# EAGLE design A6BPSLD-3 (EAGLE 7.5.0)

## Sheet 1 of 2
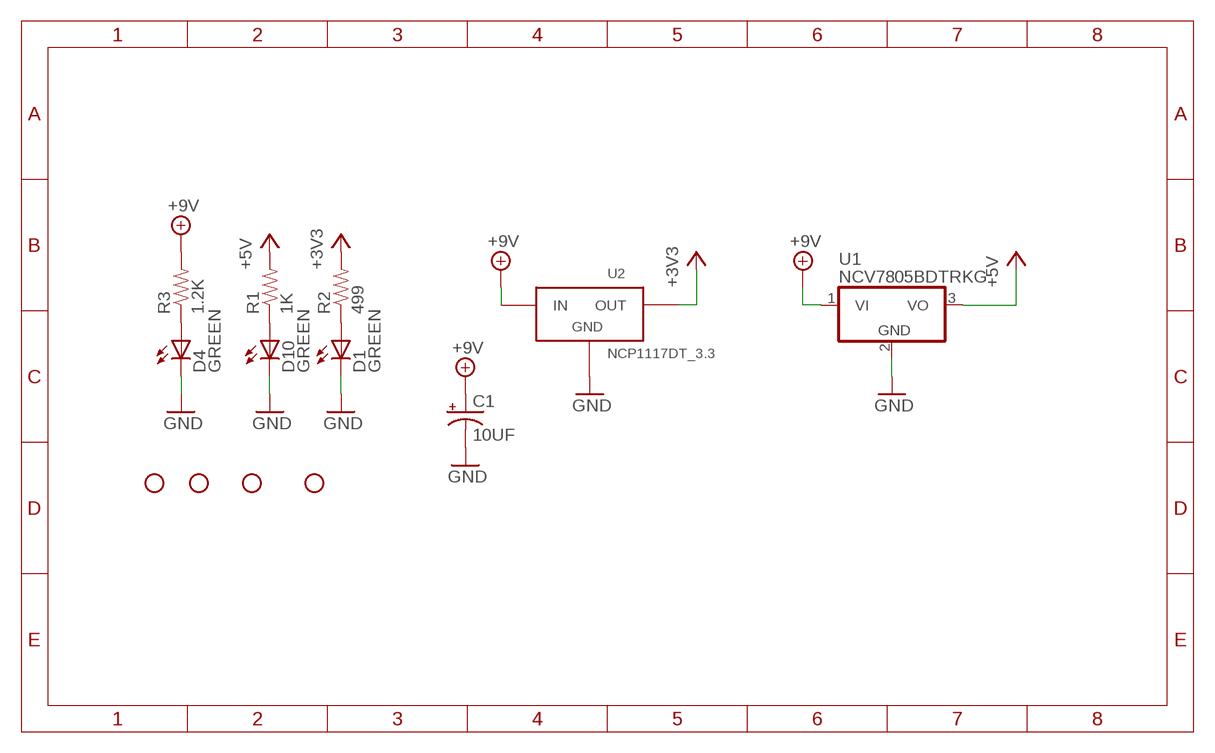
[diagram p0: schematic, sheet 1]

### Parts
C1  10UF  CAP-POL_10UF_16V  [EIA3216-16V]
D1  GREEN  LED_GREEN  [CHIP_LED0805]
D4  GREEN  LED_GREEN  [CHIP_LED0805]
D10  GREEN  LED_GREEN  [CHIP_LED0805]
R1  1K  RES_1K_1%_0805  [0805]
R2  499  RES_499_1%_0805  [0805]
R3  1.2K  RES_1.2K_1%_0805  [0805]
STANDOFF2  STAND-OFF  [STAND-OFF]
STANDOFF6  STAND-OFF  [STAND-OFF]
STANDOFF7  STAND-OFF  [STAND-OFF]
STANDOFF8  STAND-OFF  [STAND-OFF]
U1  NCV7805BDTRKG  [DPAK]
U2  NCP1117DT_3.3  [DPAK]

### Nets
+3V3: R2.2 U2.2(OUT) ; also sheet 2
+5V: R1.2 U1.3(VO) ; also sheet 2
+9V: C1.A(+) R3.2 U1.1(VI) U2.3(IN) ; also sheet 2
GND: C1.C(-) D1.C D4.C D10.C U1.2(GND) U2.1(GND) ; also sheet 2
N$3: D4.A R3.1
N$5: D1.A R2.1
N$8: D10.A R1.1

## Sheet 2 of 2
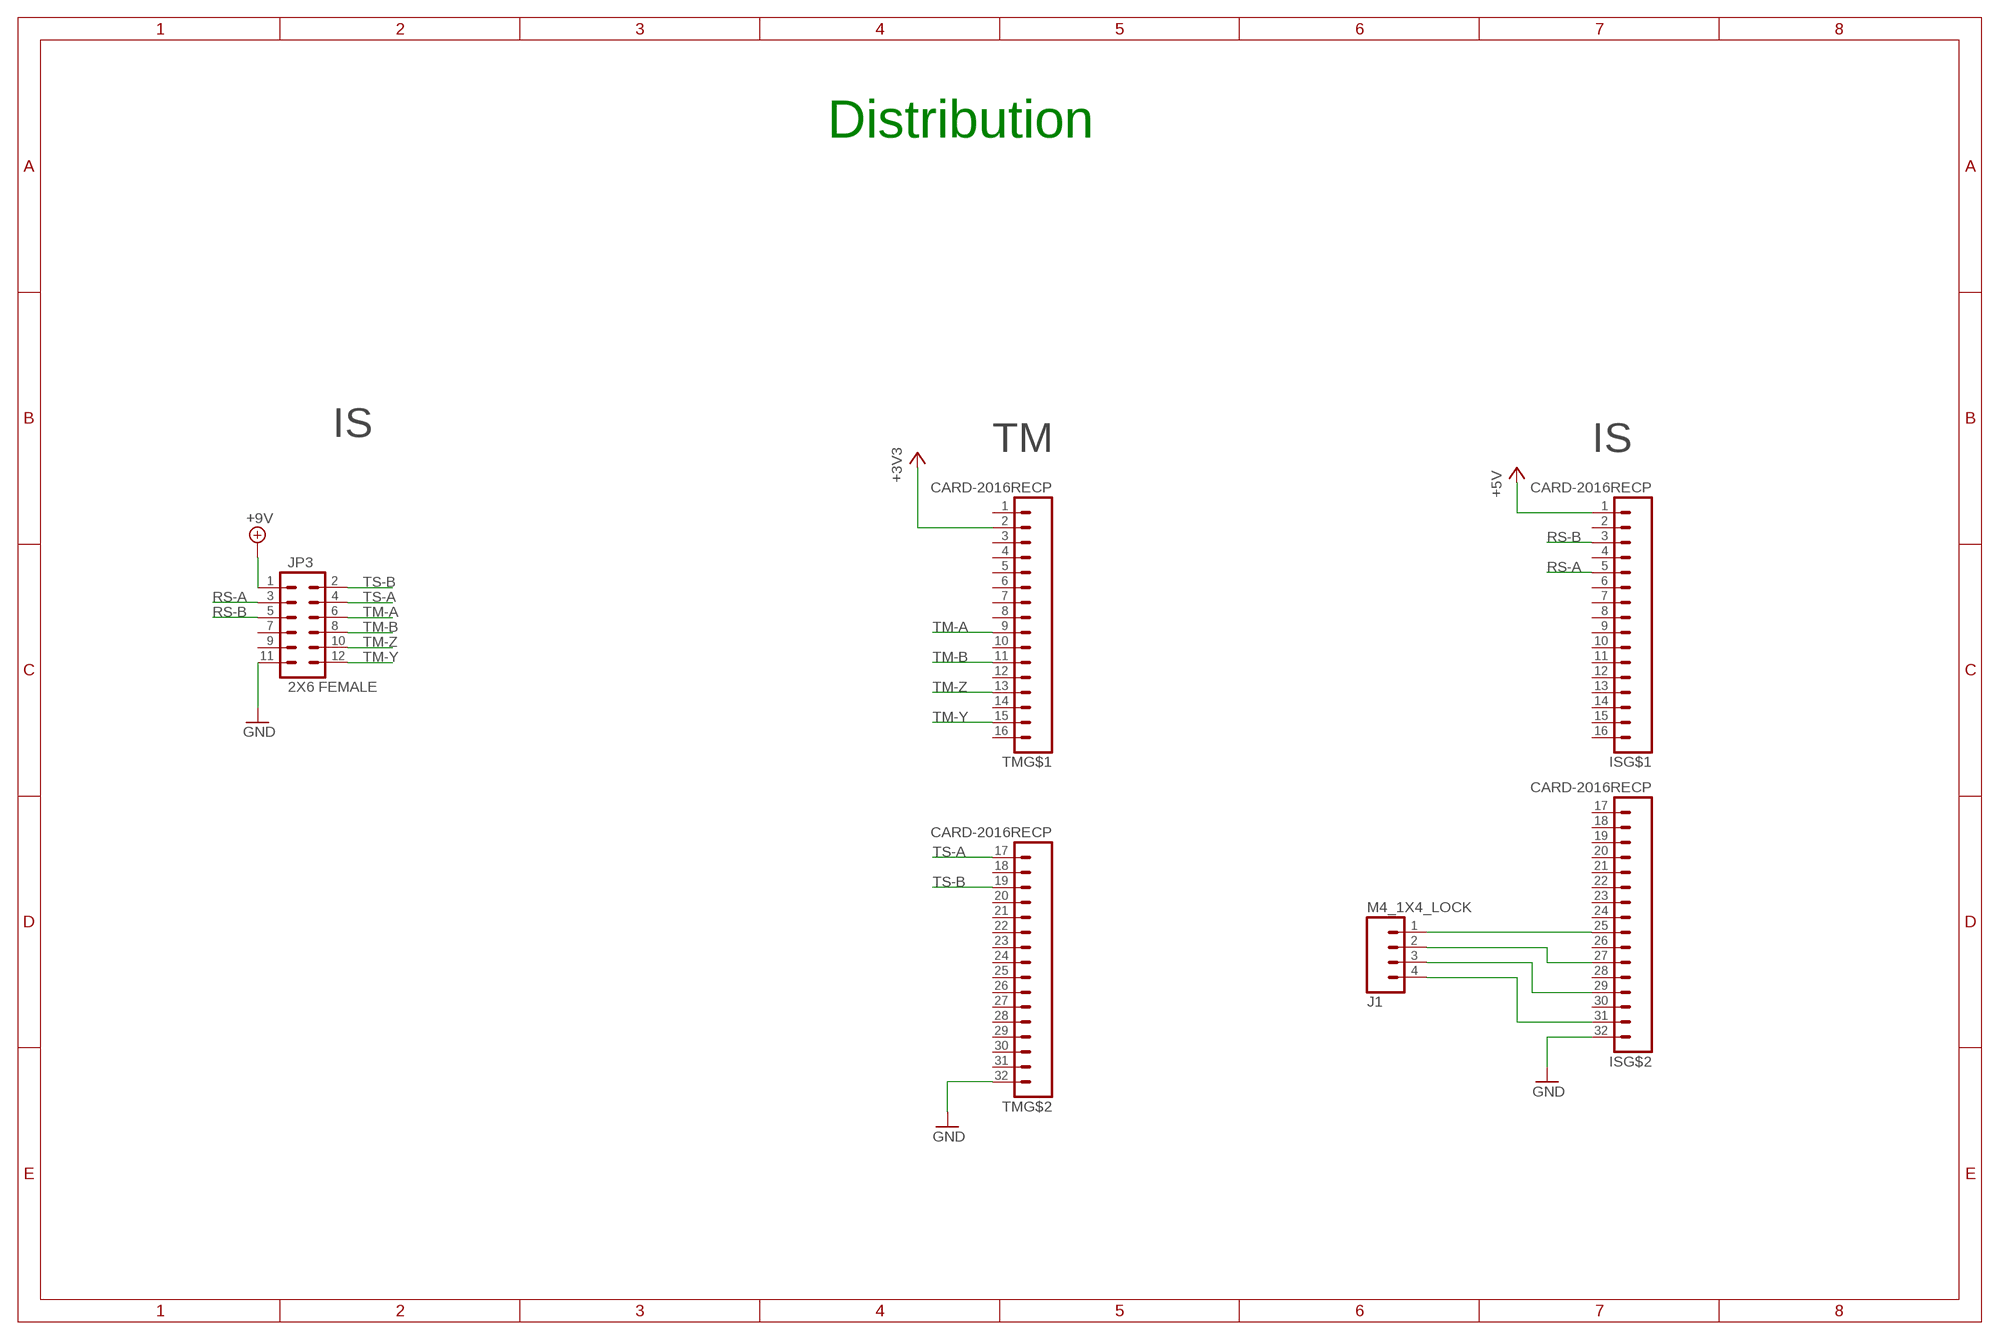
[diagram p1: schematic, sheet 2]

### Parts
IS  CARD-2016RECP  [CARD-2016-RCP]
J1  M4_1X4_LOCK  [MOLEX_1X4]
JP3  2X6 FEMALE  M06X2PTH_FEMALE  [2X6]
TM  CARD-2016RECP  [CARD-2016-RCP]

### Nets
+3V3: TM.2 ; also sheet 1
+5V: IS.1 ; also sheet 1
+9V: JP3.1 ; also sheet 1
GND: IS.32 JP3.11 TM.32 ; also sheet 1
N$6: IS.25 J1.1
N$7: IS.27 J1.2
N$9: IS.29 J1.3
N$10: IS.31 J1.4
RS-A: IS.5 JP3.3
RS-B: IS.3 JP3.5
TM-A: JP3.6 TM.9
TM-B: JP3.8 TM.11
TM-Y: JP3.12 TM.15
TM-Z: JP3.10 TM.13
TS-A: JP3.4 TM.17
TS-B: JP3.2 TM.19
Unconnected: IS.2 IS.4 IS.6 IS.7 IS.8 IS.9 IS.10 IS.11 IS.12 IS.13 IS.14 IS.15 IS.16 IS.17 IS.18 IS.19 IS.20 IS.21 IS.22 IS.23 IS.24 IS.26 IS.28 IS.30 JP3.7 JP3.9 TM.1 TM.3 TM.4 TM.5 TM.6 TM.7 TM.8 TM.10 TM.12 TM.14 TM.16 TM.18 TM.20 TM.21 TM.22 TM.23 TM.24 TM.25 TM.26 TM.27 TM.28 TM.29 TM.30 TM.31

### Notes on the sheet
- Distribution
- IS
- TM | IS

## Library data of the parts
C1 = FSAE Electric:CAP-POL; PARTNO: T491A106M016AT
D1 D4 D10 = FSAE Electric:LED; PARTNO: LTST-S220GKT
IS TM = FSAE Electric:CARD-2016
J1 = FSAE Electric:M4: Molex 1x4 Connectors; PARTNO: 0022232041
JP3 = SparkFun-Connectors:M06X2; PROD_ID: CONN-12423
R1 = FSAE Electric:RES: Resistors; PARTNO: RC0805FR-071KL
R2 = FSAE Electric:RES: Resistors; PARTNO: RC0805FR-07499RL
R3 = FSAE Electric:RES: Resistors; PARTNO: RC0805FR-071K2L
STANDOFF2 STANDOFF6-STANDOFF8 = SparkFun-Electromechanical:STAND-OFF: #4 Stand Off This is the mechanical footprint for a #4 phillips button head screw. Use the keepout ring to avoid running the screw head into surrounding components. SKU : PRT-00447
U1 = FSAE Electric:NCV7805BDTRKG; PARTNO: NCV7805BDTRKG
U2 = FSAE Electric:NCP1117DT; PARTNO: NCP1117DT33RKG

## Net classes
1 power: width 0.61 mm, drill 0.711 mm, clearance 0.203 mm

## Board
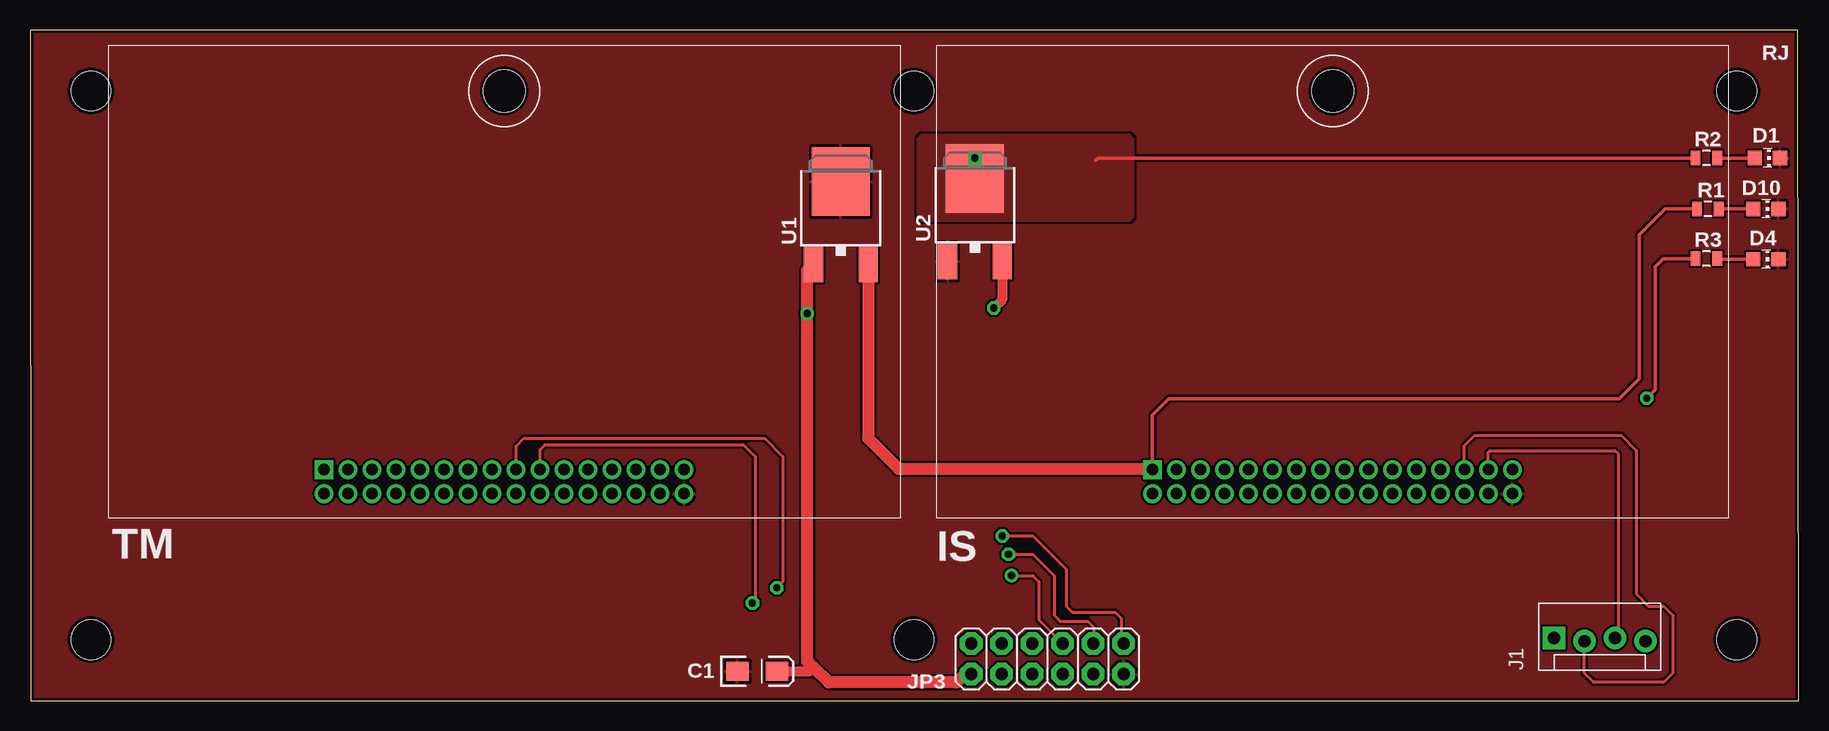
[diagram p2: board, top side]
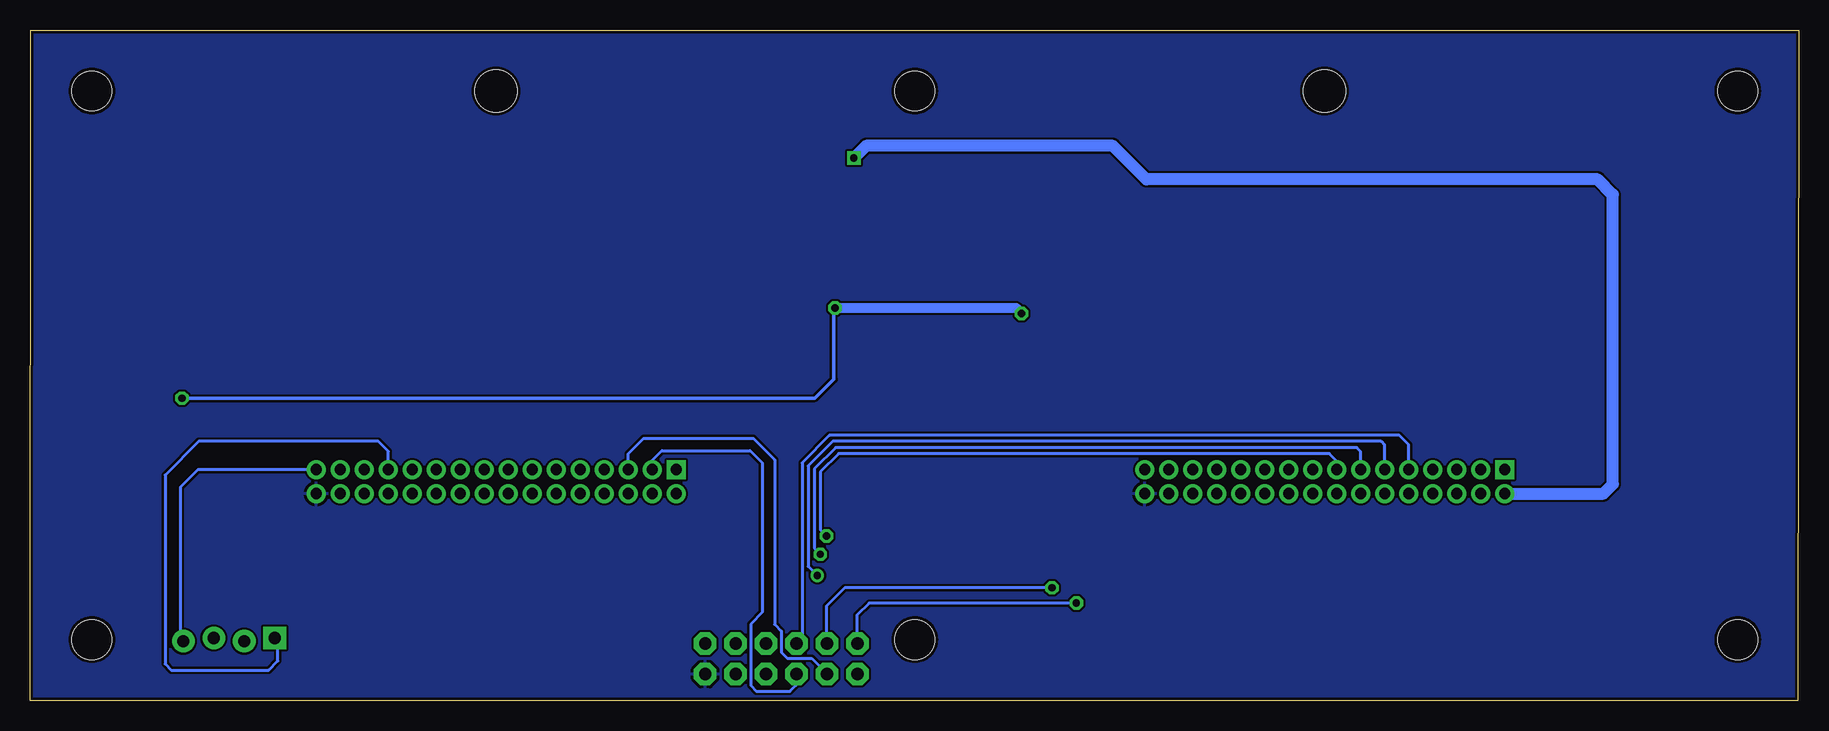
[diagram p3: board, bottom side, seen from below]

Size 147.4 x 55.88 mm. Coordinates in mm from the lower left corner, seen from the top.
Outline: 0.08,0 147.4,0 147.32,55.88 0,55.88 0.08,0
Copper layers (1*16): Top 0.035mm / dielectric 1.5mm / Bottom 0.035mm
Design rules "SparkFun4layer *": minimum track width 8mil, minimum drill 19mil, track to track 7mil, track to pad 7mil, pad to pad 7mil, via to via 7mil, smd to smd 7mil, copper to edge 10mil, drill to drill 6mil, minimum pad ring 12mil, minimum via ring 10mil, stop-mask expansion 4mil, vias tented up to drill 25mil, thermal gap 10mil

### Footprints (pad centres in the part's own frame; a part is rotated, then mirrored left to right if it is on the bottom)
EIA3216-16V = smd 1.9 x 1.6: A 1.65,0; C -1.65,0
CHIP_LED0805 = smd 1.2 x 1.2: A 0,-1.05; C 0,1.05
CARD-2016-RCP = drill 0.95 square: 1 18,4 | drill 0.95: 2 18,2; 3 20,4; 4 20,2; 5 22,4; 6 22,2; 7 24,4; 8 24,2; 9 26,4; 10 26,2; 11 28,4; 12 28,2; 13 30,4; 14 30,2; 15 32,4; 16 32,2; 17 34,4; 18 34,2; 19 36,4; 20 36,2; 21 38,4; 22 38,2; 23 40,4; 24 40,2; 25 42,4; 26 42,2; 27 44,4; 28 44,2; 29 46,4; 30 46,2; 31 48,4; 32 48,2 | hole 3.5: 33.02,35.56
MOLEX_1X4 = drill 1.016 pad 1.88 square: 1 -3.81,0.127 | drill 1.016 pad 1.88: 2 -1.27,-0.127; 3 1.27,0.127; 4 3.81,-0.127
2X6 = drill 1.016 pad 1.88 octagon: 1 0,0; 2 0,2.54; 3 2.54,0; 4 2.54,2.54; 5 5.08,0; 6 5.08,2.54; 7 7.62,0; 8 7.62,2.54; 9 10.16,0; 10 10.16,2.54; 11 12.7,0; 12 12.7,2.54
0805 = smd 0.8 x 1.2: 1 -0.9,0; 2 0.9,0
STAND-OFF = hole 3.302: 0,0
DPAK = smd 1.6 x 3: 1 -2.28,-4.04; 3 2.28,-4.04 | smd 4.826 x 5.715: 2 0,2.858

### Placement (x,y rotation side)
C1  60.6,2.44 0 top
D1  144.78,45.21 270 top
D4  144.65,36.78 270 top
D10  144.65,40.97 270 top
IS  75.54,15.24 0 top
J1  130.81,5.08 0 top
JP3  78.44,2.21 0 top
R1  139.83,40.97 180 top
R2  139.7,45.21 180 top
R3  139.7,36.83 180 top
STANDOFF1  STAND-OFF  [STAND-OFF]  142.24,50.8 0 top
STANDOFF2  73.66,5.08 90 top
STANDOFF4  STAND-OFF  [STAND-OFF]  5.08,50.8 0 top
STANDOFF6  5.08,5.08 0 top
STANDOFF7  142.24,5.08 0 top
STANDOFF8  73.66,50.8 0 top
TM  6.5,15.24 0 top
U1  67.56,40.39 0 top
U2  78.74,40.64 0 top

### Tracks (layer width: path | path; a pad name or v marks a point on that pad's centre or on a via)
+3V3  (via drill 0.6)
  Top 0.305: R2.2 89,45.21 88.8,45.01
  Top 1.016: v78.74,45.21 78.74,44.7 78.49,44.45 78.49,43.75 U2.2
  Bottom 1.016: TM.2 16.29,17.24 15.49,18.03 15.49,42.16 16.76,43.43 54.36,43.43 57.15,46.23 77.72,46.23 v78.74,45.21
  pour Top (no thermals): 74.88,47.14 91.59,47.14 91.9,46.84 91.9,40.28 91.59,39.98 74.27,39.98 74.02,40.23 74.02,46.84 74.32,47.14
+5V
  Top 0.305: R1.2 136.27,40.97 134.11,38.81 134.11,26.82 132.44,25.15 94.89,25.15 93.52,23.77 93.52,19.26 IS.1
  Top 1.016: U1.3 69.84,21.85 72.39,19.3 93.48,19.3 IS.1
+9V  (via drill 0.6)
  Top 0.305: R3.2 136.09,36.83 135.43,36.17 135.43,25.91 v134.72,25.2
  Top 0.813: C1.A 64.92,2.44 65.28,2.79 | U2.3 81.02,33.42 v80.31,32.72
  Top 1.016: JP3.1 77.9,2.21 77.22,1.52 66.55,1.52 65.28,2.79 64.77,3.3 v64.77,32.26 64.77,35.83 U1.1
  Bottom 0.305: v134.72,25.2 81.99,25.2 80.42,26.77 80.42,32.61 v80.31,32.72
  Bottom 0.813: v80.31,32.72 65.23,32.72 v64.77,32.26
GND
  pour Bottom (rank 5): -1.02,56.64 150.11,56.64 150.11,-1.52 -1.02,-1.52
  pour Top (rank 5): -0.51,56.13 149.35,56.13 149.35,-0.76 -0.51,-0.76
N$3
  Top 0.305: D4.A 140.65,36.78 R3.1
N$5
  Top 0.305: D1.A R2.1
N$6
  Bottom 0.254: IS.25 117.54,20.77 118.36,21.59 133.35,21.59 136.14,18.8 136.14,3.05 135.64,2.54 127.51,2.54 126.75,3.3 126.75,4.95 J1.1
N$7
  Top 0.254: IS.27 119.54,21.24 120.4,22.1 132.59,22.1 133.86,20.83 133.86,8.89 134.87,7.87 136.14,7.87 136.91,7.11 136.91,2.29 136.14,1.52 130.3,1.52 129.54,2.29 J1.2
N$8
  Top 0.305: D10.A R1.1
N$9
  Top 0.254: IS.29 121.54,20.7 121.67,20.83 132.08,20.83 132.33,20.57 132.33,5.46 J1.3
N$10
  Bottom 0.254: IS.31 133.41,19.24 134.87,17.78 134.87,5.21 J1.4
RS-A
  Bottom 0.254: IS.5 97.54,20.57 96.27,21.84 87.12,21.84 85.34,20.07 85.34,6.35 84.78,5.79 84.78,4.01 84.28,3.5 82.27,3.5 JP3.3
RS-B
  Bottom 0.254: IS.3 95.54,20.03 94.74,20.83 87.38,20.83 86.36,19.81 86.36,7.37 87.33,6.35 87.33,1.27 86.87,0.76 84.07,0.76 83.57,1.27 83.57,2.16 JP3.5
TM-A
  Bottom 0.254: TM.9 32.5,21.33 33.27,22.1 80.77,22.1 83.06,19.81 83.06,5.21 JP3.6
TM-B  (via drill 0.6)
  Top 0.254: v81.79,10.41 83.57,10.41 84.07,9.91 84.07,6.73 JP3.8
  Bottom 0.254: TM.11 34.5,21.29 34.8,21.59 80.52,21.59 82.55,19.56 82.55,11.18 v81.79,10.41
TM-Y  (via drill 0.6)
  Top 0.254: v81.03,13.72 83.57,13.72 86.36,10.92 86.36,7.87 86.87,7.37 90.42,7.37 90.93,6.86 90.93,4.95 JP3.12
  Bottom 0.254: TM.15 38.5,19.96 39.12,20.57 80.01,20.57 81.53,19.05 81.53,14.22 v81.03,13.72
TM-Z  (via drill 0.6)
  Top 0.254: v81.53,12.19 83.57,12.19 85.34,10.41 85.34,7.11 85.85,6.6 88.14,6.6 88.65,6.1 88.65,4.8 JP3.10
  Bottom 0.254: TM.13 36.5,20.75 36.83,21.08 80.26,21.08 82.04,19.3 82.04,12.7 v81.53,12.19
TS-A  (via drill 0.6)
  Top 0.254: TM.17 40.5,21.2 41.15,21.84 61.21,21.84 62.74,20.32 62.74,9.91 v62.23,9.4
  Bottom 0.254: v62.23,9.4 79.5,9.4 81.03,7.87 81.03,4.8 JP3.4
TS-B  (via drill 0.6)
  Top 0.254: TM.19 42.5,20.91 42.93,21.34 59.44,21.34 60.45,20.32 60.45,8.38 v60.2,8.13
  Bottom 0.254: v60.2,8.13 77.47,8.13 78.49,7.11 78.49,4.8 JP3.2

### Text on the board
tPlace: RJ